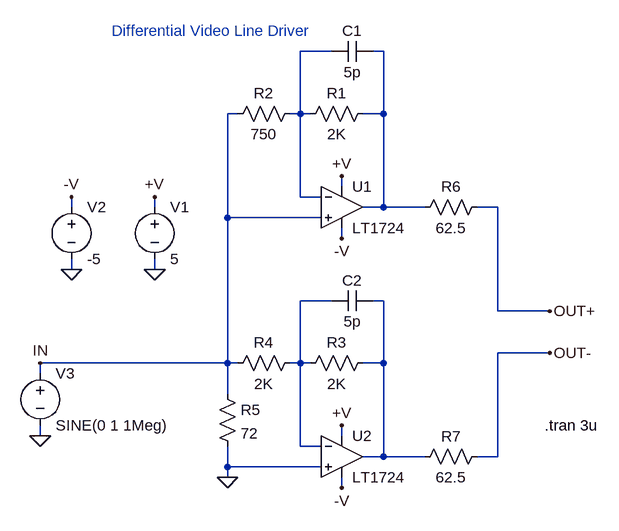
[diagram p0: schematic 1724.asc]
1724.asc, the LTspice schematic file:
Version 4
SHEET 1 896 744
WIRE 176 0 128 0
WIRE 256 0 240 0
WIRE 32 96 16 96
WIRE 128 96 128 0
WIRE 128 96 112 96
WIRE 144 96 128 96
WIRE 256 96 256 0
WIRE 256 96 224 96
WIRE 192 208 192 192
WIRE 128 224 128 96
WIRE 160 224 128 224
WIRE -224 240 -224 224
WIRE -96 240 -96 224
WIRE 256 240 256 96
WIRE 256 240 224 240
WIRE 320 240 256 240
WIRE 432 240 400 240
WIRE 16 256 16 96
WIRE 160 256 16 256
WIRE 192 288 192 272
WIRE -224 336 -224 320
WIRE -96 336 -96 320
WIRE 176 384 128 384
WIRE 256 384 240 384
WIRE 432 400 432 240
WIRE 512 400 432 400
WIRE 512 464 432 464
WIRE 16 480 16 256
WIRE 16 480 -272 480
WIRE 32 480 16 480
WIRE 128 480 128 384
WIRE 128 480 112 480
WIRE 144 480 128 480
WIRE 256 480 256 384
WIRE 256 480 224 480
WIRE -272 496 -272 480
WIRE 16 528 16 480
WIRE -272 592 -272 576
WIRE 192 592 192 576
WIRE 128 608 128 480
WIRE 160 608 128 608
WIRE 256 624 256 480
WIRE 256 624 224 624
WIRE 320 624 256 624
WIRE 432 624 432 464
WIRE 432 624 400 624
WIRE 16 640 16 608
WIRE 160 640 16 640
WIRE 16 656 16 640
WIRE 192 672 192 656
FLAG -96 336 0
FLAG 192 192 +V
FLAG -96 224 +V
FLAG 192 288 -V
FLAG -224 336 0
FLAG -224 224 -V
FLAG -272 592 0
FLAG 192 576 +V
FLAG 192 672 -V
FLAG 16 656 0
FLAG -272 480 IN
FLAG 512 400 OUT+
FLAG 512 464 OUT-
SYMBOL voltage -96 224 R0
SYMATTR InstName V1
SYMATTR Value 5
SYMBOL voltage -224 224 R0
SYMATTR InstName V2
SYMATTR Value -5
SYMBOL res 240 80 R90
WINDOW 0 0 56 VBottom 2
WINDOW 3 32 56 VTop 2
SYMATTR InstName R1
SYMATTR Value 2K
SYMBOL res 128 80 R90
WINDOW 0 0 56 VBottom 2
WINDOW 3 32 56 VTop 2
SYMATTR InstName R2
SYMATTR Value 750
SYMBOL voltage -272 480 R0
SYMATTR InstName V3
SYMATTR Value SINE(0 1 1Meg)
SYMBOL cap 240 -16 R90
WINDOW 0 0 32 VBottom 2
WINDOW 3 32 32 VTop 2
SYMATTR InstName C1
SYMATTR Value 5p
SYMBOL res 240 464 R90
WINDOW 0 0 56 VBottom 2
WINDOW 3 32 56 VTop 2
SYMATTR InstName R3
SYMATTR Value 2K
SYMBOL res 128 464 R90
WINDOW 0 0 56 VBottom 2
WINDOW 3 32 56 VTop 2
SYMATTR InstName R4
SYMATTR Value 2K
SYMBOL cap 240 368 R90
WINDOW 0 0 32 VBottom 2
WINDOW 3 32 32 VTop 2
SYMATTR InstName C2
SYMATTR Value 5p
SYMBOL res 0 512 R0
SYMATTR InstName R5
SYMATTR Value 72
SYMBOL res 304 256 R270
WINDOW 0 32 56 VTop 2
WINDOW 3 0 56 VBottom 2
SYMATTR InstName R6
SYMATTR Value 62.5
SYMBOL res 304 640 R270
WINDOW 0 32 56 VTop 2
WINDOW 3 0 56 VBottom 2
SYMATTR InstName R7
SYMATTR Value 62.5
SYMBOL opamps\\LT1724 192 176 R0
SYMATTR InstName U1
SYMBOL opamps\\LT1724 192 560 R0
SYMATTR InstName U2
TEXT 504 576 Left 2 !.tran 3u
TEXT -8 -16 Bottom 2 ;Differential Video Line Driver

The netlist it stands for:
* 1724.asc
V1 +V 0 5
V2 -V 0 -5
R1 N002 N001 2K
R2 N001 IN 750
V3 IN 0 SINE(0 1 1Meg)
C1 N002 N001 5p
R3 N004 N003 2K
R4 N003 IN 2K
C2 N004 N003 5p
R5 IN 0 72
R6 N002 OUT+ 62.5
R7 N004 OUT- 62.5
XU1 IN N001 +V -V N002 LT1722  ; LT1724, pins In+ In- V+ V- OUT
XU2 0 N003 +V -V N004 LT1722  ; LT1724, pins In+ In- V+ V- OUT
.tran 3u
* Differential Video Line Driver
.lib LTC.lib
.backanno
.end